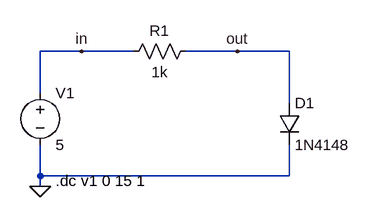
[diagram p0: schematic asignment2.2.asc]
asignment2.2.asc, the LTspice schematic file:
Version 4
SHEET 1 880 680
WIRE 176 176 112 176
WIRE 256 176 176 176
WIRE 416 176 336 176
WIRE 496 176 416 176
WIRE 112 240 112 176
WIRE 496 256 496 176
WIRE 112 368 112 320
WIRE 496 368 496 320
WIRE 496 368 112 368
WIRE 112 384 112 368
FLAG 112 384 0
FLAG 176 176 in
FLAG 416 176 out
SYMBOL res 352 160 R90
WINDOW 0 0 56 VBottom 2
WINDOW 3 32 56 VTop 2
SYMATTR InstName R1
SYMATTR Value 1k
SYMBOL voltage 112 224 R0
SYMATTR InstName V1
SYMATTR Value 5
SYMBOL diode 480 256 R0
SYMATTR InstName D1
SYMATTR Value 1N4148
TEXT 136 376 Left 2 !.dc v1 0 15 1

The netlist it stands for:
* asignment2.2.asc
R1 out in 1k
V1 in 0 5
D1 out 0 1N4148
.model D D
.lib standard.dio
.dc v1 0 15 1
.backanno
.end